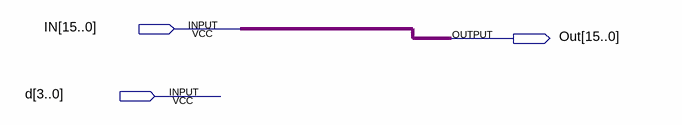
[diagram p0: schematic sheet]
// Quartus schematic 16_4_SLR.bdf as structural Verilog: 0 symbols, 3 pins
module \16_4_SLR  (
  input  [15:0] IN,
  input  [3:0] d,
  output [15:0] Out
);


  assign Out = IN;
endmodule
